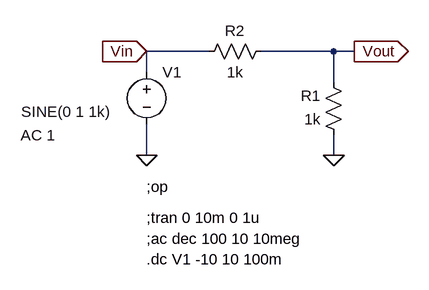
[diagram p0: schematic VoltageDivider.asc]
VoltageDivider.asc, the LTspice schematic file:
Version 4
SHEET 1 1220 680
WIRE 80 -160 -16 -160
WIRE 272 -160 160 -160
WIRE 304 -160 272 -160
WIRE -16 -128 -16 -160
WIRE 272 -112 272 -160
WIRE -16 0 -16 -48
WIRE 272 0 272 -32
FLAG -16 0 0
FLAG 272 0 0
FLAG 304 -160 Vout
IOPIN 304 -160 Out
FLAG -16 -160 Vin
IOPIN -16 -160 In
SYMBOL res 176 -176 R90
WINDOW 0 0 56 VBottom 2
WINDOW 3 32 56 VTop 2
SYMATTR InstName R2
SYMATTR Value 1k
SYMBOL voltage -16 -144 R0
WINDOW 3 -193 77 Left 2
WINDOW 123 -194 113 Left 2
WINDOW 39 0 0 Left 2
SYMATTR Value SINE(0 1 1k)
SYMATTR Value2 AC 1
SYMATTR InstName V1
SYMBOL res 288 -16 R180
WINDOW 0 36 76 Left 2
WINDOW 3 36 40 Left 2
SYMATTR InstName R1
SYMATTR Value 1k
TEXT -16 48 Left 2 !;op
TEXT -16 96 Left 2 !;tran 0 10m 0 1u
TEXT -16 128 Left 2 !;ac dec 100 10 10meg
TEXT -16 160 Left 2 !.dc V1 -10 10 100m

The netlist it stands for:
* VoltageDivider.asc
R2 Vout Vin 1k
V1 Vin 0 SINE(0 1 1k) AC 1
R1 0 Vout 1k
;op
;tran 0 10m 0 1u
;ac dec 100 10 10meg
.dc V1 -10 10 100m
.backanno
.end